# EAGLE design Nixie_ver1 (EAGLE 9.6.2)
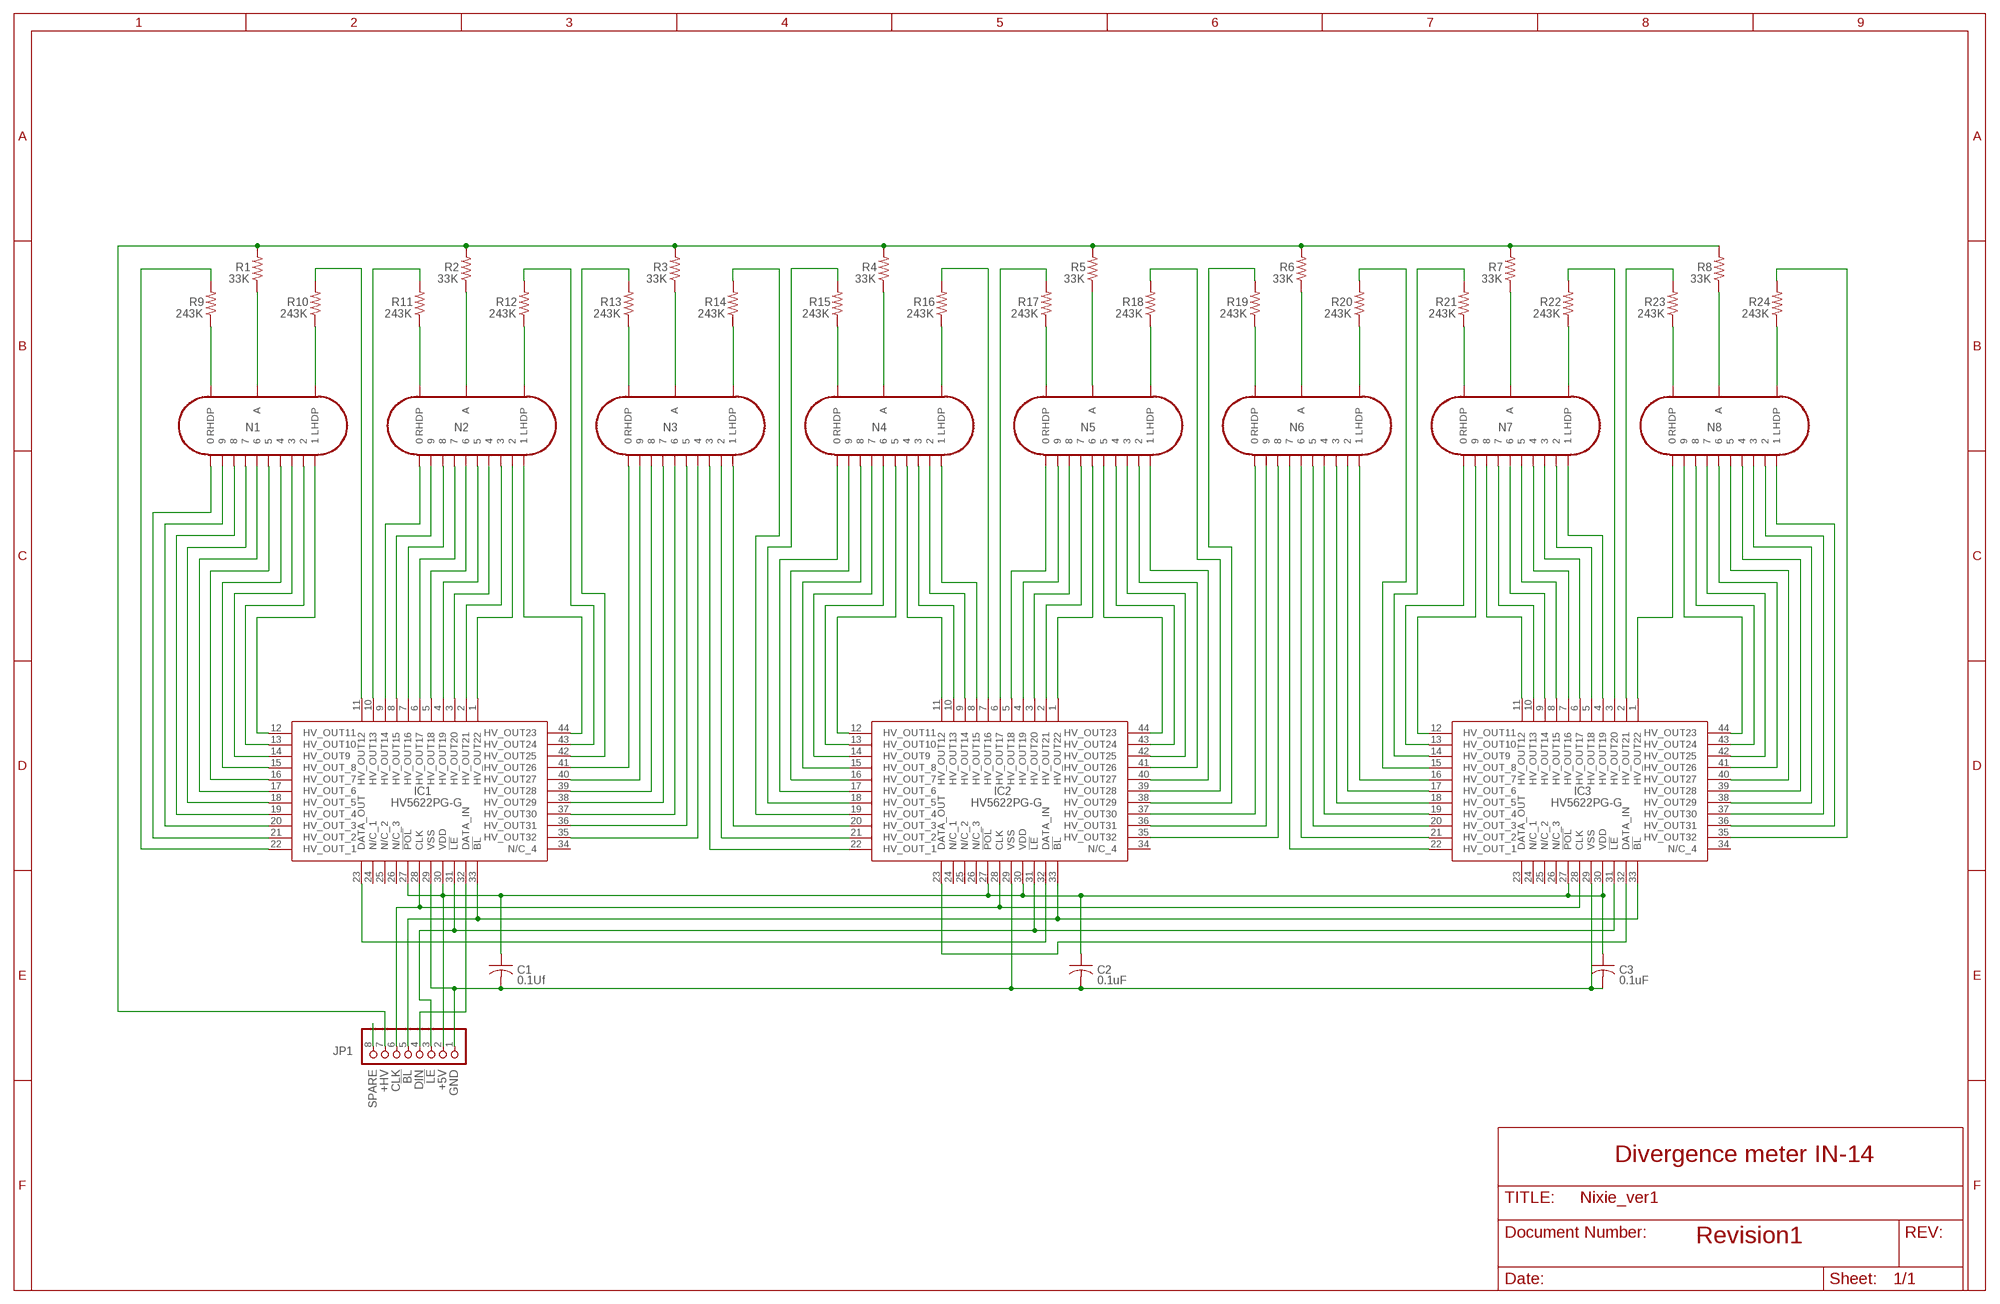
[diagram p0: schematic, sheet 1]

## Parts
C1  0.1Uf  C-US025-024X044  [C025-024X044]
C2  0.1uF  C-US025-024X044  [C025-024X044]
C3  0.1uF  C-US025-024X044  [C025-024X044]
IC1  HV5622PG-G  [QFP80P1390X1390X235-44N]
IC2  HV5622PG-G  [QFP80P1390X1390X235-44N]
IC3  HV5622PG-G  [QFP80P1390X1390X235-44N]
JP1  PINHD-1X8  [1X08]
N1  IN-14  [IN-14]
N2  IN-14  [IN-14]
N3  IN-14  [IN-14]
N4  IN-14  [IN-14]
N5  IN-14  [IN-14]
N6  IN-14  [IN-14]
N7  IN-14  [IN-14]
N8  IN-14  [IN-14]
R1  33K  R-US_0204/7  [0204/7]
R2  33K  R-US_0204/7  [0204/7]
R3  33K  R-US_0204/7  [0204/7]
R4  33K  R-US_0204/7  [0204/7]
R5  33K  R-US_0204/7  [0204/7]
R6  33K  R-US_0204/7  [0204/7]
R7  33K  R-US_0204/7  [0204/7]
R8  33K  R-US_0204/7  [0204/7]
R9  243K  R-US_0204/7  [0204/7]
R10  243K  R-US_0204/7  [0204/7]
R11  243K  R-US_0204/7  [0204/7]
R12  243K  R-US_0204/7  [0204/7]
R13  243K  R-US_0204/7  [0204/7]
R14  243K  R-US_0204/7  [0204/7]
R15  243K  R-US_0204/7  [0204/7]
R16  243K  R-US_0204/7  [0204/7]
R17  243K  R-US_0204/7  [0204/7]
R18  243K  R-US_0204/7  [0204/7]
R19  243K  R-US_0204/7  [0204/7]
R20  243K  R-US_0204/7  [0204/7]
R21  243K  R-US_0204/7  [0204/7]
R22  243K  R-US_0204/7  [0204/7]
R23  243K  R-US_0204/7  [0204/7]
R24  243K  R-US_0204/7  [0204/7]

## Nets
!BL!: IC1.33(!BL) IC2.33(!BL) IC3.33(!BL) JP1.5
!LE!: IC1.31(!LE) IC2.31(!LE) IC3.31(!LE) JP1.3
+5V: C1.1 C2.1 C3.1 IC1.27(!POL) IC1.30(VDD) IC2.27(!POL) IC2.30(VDD) IC3.27(!POL) IC3.30(VDD) JP1.2
+HV: JP1.7 R1.2 R2.2 R3.2 R4.2 R5.2 R6.2 R7.2 R8.2
CLK: IC1.28(CLK) IC2.28(CLK) IC3.28(CLK) JP1.6
DIN: IC1.32(DATA_IN) JP1.4
GND: C1.2 C2.2 C3.2 IC1.29(VSS) IC2.29(VSS) IC3.29(VSS) JP1.1
N$1: IC1.23(DATA_OUT) IC2.32(DATA_IN)
N$2: IC2.23(DATA_OUT) IC3.32(DATA_IN)
N$3: IC1.11(HV_OUT12) R10.2
N$4: IC1.13(HV_OUT10) N1.2
N$5: IC1.14(HV_OUT9) N1.3
N$6: IC1.15(HV_OUT_8) N1.4
N$7: IC1.16(HV_OUT_7) N1.5
N$8: IC1.17(HV_OUT_6) N1.6
N$9: IC1.18(HV_OUT_5) N1.7
N$10: IC1.19(HV_OUT_4) N1.8
N$11: IC1.20(HV_OUT_3) N1.9
N$12: IC1.12(HV_OUT11) N1.1
N$13: IC1.21(HV_OUT_2) N1.0
N$14: IC1.22(HV_OUT_1) R9.2
N$15: N1.RHDP R9.1
N$16: N1.LHDP R10.1
N$17: IC1.10(HV_OUT13) R11.2
N$18: N1.A R1.1
N$19: N2.RHDP R11.1
N$20: N2.A R2.1
N$21: N2.LHDP R12.1
N$22: IC1.9(HV_OUT14) N2.0
N$23: IC1.8(HV_OUT15) N2.9
N$24: IC1.7(HV_OUT16) N2.8
N$25: IC1.6(HV_OUT17) N2.7
N$26: IC1.5(HV_OUT18) N2.6
N$27: IC1.4(HV_OUT19) N2.5
N$28: IC1.3(HV_OUT20) N2.4
N$29: IC1.2(HV_OUT21) N2.3
N$30: IC1.1(HV_OUT22) N2.2
N$31: IC1.44(HV_OUT23) N2.1
N$32: IC1.43(HV_OUT24) R12.2
N$33: IC1.42(HV_OUT25) R13.2
N$34: N3.RHDP R13.1
N$35: N3.A R3.1
N$36: N3.LHDP R14.1
N$37: IC1.41(HV_OUT26) N3.0
N$38: IC1.40(HV_OUT27) N3.9
N$39: IC1.39(HV_OUT28) N3.8
N$40: IC1.38(HV_OUT29) N3.7
N$41: IC1.37(HV_OUT30) N3.6
N$42: IC1.36(HV_OUT31) N3.5
N$43: IC1.35(HV_OUT32) N3.4
N$44: IC2.22(HV_OUT_1) N3.3
N$45: IC2.21(HV_OUT_2) N3.2
N$46: IC2.20(HV_OUT_3) N3.1
N$47: IC2.19(HV_OUT_4) R14.2
N$48: IC2.18(HV_OUT_5) R15.2
N$49: N4.RHDP R15.1
N$50: N4.A R4.1
N$51: N4.LHDP R16.1
N$52: IC2.17(HV_OUT_6) N4.0
N$53: IC2.16(HV_OUT_7) N4.9
N$54: IC2.15(HV_OUT_8) N4.8
N$55: IC2.14(HV_OUT9) N4.7
N$56: IC2.13(HV_OUT10) N4.6
N$57: IC2.1(HV_OUT22) N5.6
N$58: IC2.11(HV_OUT12) N4.4
N$59: IC2.10(HV_OUT13) N4.3
N$60: IC2.9(HV_OUT14) N4.2
N$61: IC2.8(HV_OUT15) N4.1
N$62: IC2.7(HV_OUT16) R16.2
N$63: IC2.6(HV_OUT17) R17.2
N$64: N5.RHDP R17.1
N$65: N5.A R5.1
N$66: N5.LHDP R18.1
N$67: IC2.5(HV_OUT18) N5.0
N$68: IC2.4(HV_OUT19) N5.9
N$69: IC2.3(HV_OUT20) N5.8
N$70: IC2.2(HV_OUT21) N5.7
N$71: N6.RHDP R19.1
N$72: IC2.44(HV_OUT23) N5.5
N$73: IC2.43(HV_OUT24) N5.4
N$74: IC2.42(HV_OUT25) N5.3
N$75: IC2.41(HV_OUT26) N5.2
N$76: IC2.40(HV_OUT27) N5.1
N$77: IC2.39(HV_OUT28) R18.2
N$78: IC2.38(HV_OUT29) R19.2
N$79: IC2.12(HV_OUT11) N4.5
N$80: N6.A R6.1
N$81: N6.LHDP R20.1
N$82: N7.RHDP R21.1
N$83: N7.A R7.1
N$84: N7.LHDP R22.1
N$85: N8.RHDP R23.1
N$86: N8.A R8.1
N$87: N8.LHDP R24.1
N$88: IC2.37(HV_OUT30) N6.0
N$89: IC2.36(HV_OUT31) N6.9
N$90: IC2.35(HV_OUT32) N6.8
N$91: IC3.22(HV_OUT_1) N6.7
N$92: IC3.21(HV_OUT_2) N6.6
N$93: IC3.20(HV_OUT_3) N6.5
N$94: IC3.19(HV_OUT_4) N6.4
N$95: IC3.18(HV_OUT_5) N6.3
N$96: IC3.17(HV_OUT_6) N6.2
N$97: IC3.16(HV_OUT_7) N6.1
N$98: IC3.15(HV_OUT_8) R20.2
N$99: IC3.14(HV_OUT9) R21.2
N$100: IC3.13(HV_OUT10) N7.0
N$101: IC3.12(HV_OUT11) N7.9
N$102: IC3.11(HV_OUT12) N7.8
N$103: IC3.10(HV_OUT13) N7.7
N$104: IC3.9(HV_OUT14) N7.6
N$105: IC3.8(HV_OUT15) N7.5
N$106: IC3.7(HV_OUT16) N7.4
N$107: IC3.6(HV_OUT17) N7.3
N$108: IC3.5(HV_OUT18) N7.2
N$109: IC3.4(HV_OUT19) N7.1
N$110: IC3.3(HV_OUT20) R22.2
N$111: IC3.2(HV_OUT21) R23.2
N$112: IC3.1(HV_OUT22) N8.0
N$113: IC3.44(HV_OUT23) N8.9
N$114: IC3.43(HV_OUT24) N8.8
N$115: IC3.42(HV_OUT25) N8.7
N$116: IC3.41(HV_OUT26) N8.6
N$117: IC3.40(HV_OUT27) N8.5
N$118: IC3.39(HV_OUT28) N8.4
N$119: IC3.38(HV_OUT29) N8.3
N$120: IC3.37(HV_OUT30) N8.2
N$121: IC3.36(HV_OUT31) N8.1
N$122: IC3.35(HV_OUT32) R24.2
SPARE: JP1.8
Unconnected: IC1.24(N/C_1) IC1.25(N/C_2) IC1.26(N/C_3) IC1.34(N/C_4) IC2.24(N/C_1) IC2.25(N/C_2) IC2.26(N/C_3) IC2.34(N/C_4) IC3.23(DATA_OUT) IC3.24(N/C_1) IC3.25(N/C_2) IC3.26(N/C_3) IC3.34(N/C_4)

## Notes on the sheet
- Divergence meter IN-14
- Revision1

## Library data of the parts
C1-C3 = rcl:C-US: CAPACITOR, American symbol; SPICEPREFIX: C
IC1-IC3 = SamacSys_Parts:HV5622PG-G: Serial to Parallel Logic Converters 220V 32Ch Open D Out Source: Datasheet <https://componentsearchengine.com/Datasheets/1/HV5622PG-G.pdf>; DESCRIPTION: Serial to Parallel Logic Converters 220V 32Ch Open D Out; HEIGHT: 2.35mm; MANUFACTURER_NAME: Microchip; MANUFACTURER_PART_NUMBER: HV5622PG-G; MOUSER_PART_NUMBER: 689-HV5622PG-G; MOUSER_PRICE-STOCK: https://www.mouser.co.uk/ProductDetail/Microchip-Technology/HV5622PG-G?qs=jjdktuRV%2Fgg6x1DCsLKbaw%3D%3D
JP1 = pinhead:PINHD-1X8: PIN HEADER
N1-N8 = russian-nixies:IN-14: IN-14: medium numeric frontview nixie tube
R1-R24 = rcl:R-US_: RESISTOR, American symbol; SPICEPREFIX: R

## Board
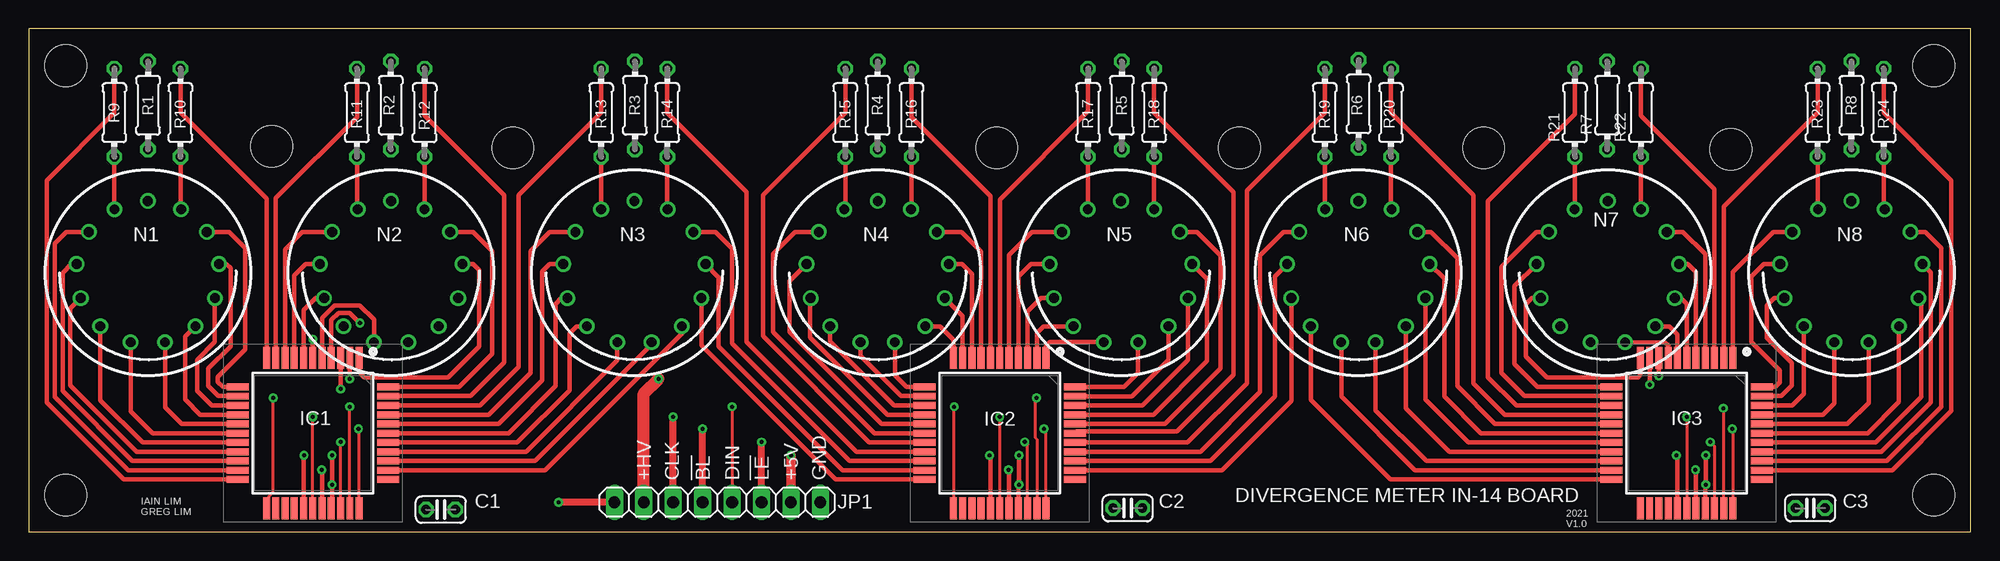
[diagram p1: board, top side]
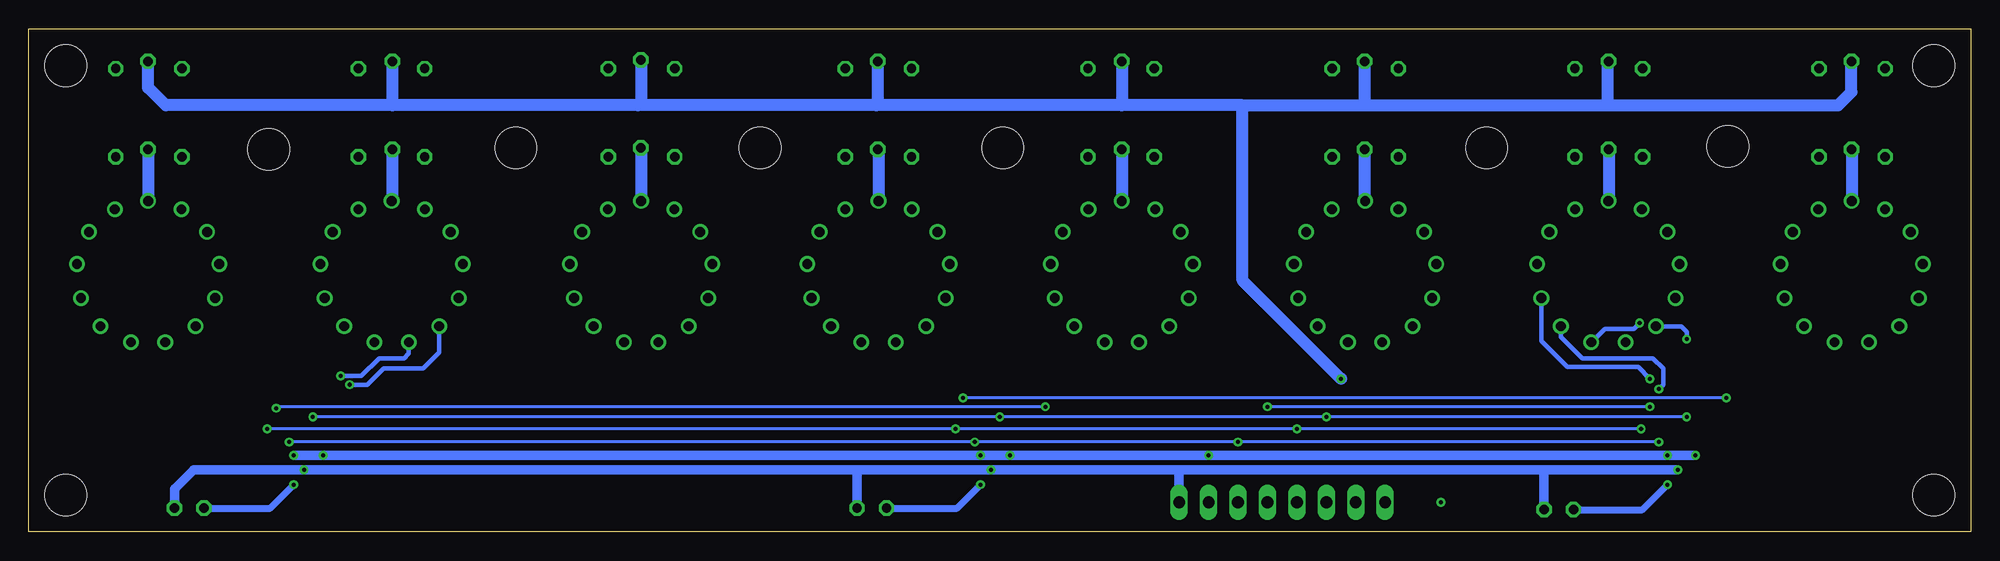
[diagram p2: board, bottom side, seen from below]

Size 167.64 x 43.43 mm. Coordinates in mm from the lower left corner, seen from the top.
Outline: 0,0 167.64,0 167.64,43.43 0,43.43 0,0
Copper layers (1*16): Top 0.035mm / dielectric 1.5mm / Bottom 0.035mm
Design rules "default": minimum track width 6mil, minimum drill 0.35mm, track to track 6mil, track to pad 6mil, pad to pad 6mil, via to via 6mil, smd to smd 6mil, copper to edge 40mil, drill to drill 6mil, minimum pad ring 10mil, minimum via ring 8mil, stop-mask expansion 4mil, vias tented up to drill 0mil, thermal gap 10mil
Holes 3.58 mm at 3.17,3.17 3.17,40.26 164.47,40.26 164.47,3.17 20.95,33.27 41.78,33.15 104.52,33.15 83.57,33.15 125.6,33.15 146.94,33.02

### Footprints (pad centres in the part's own frame; a part is rotated, then mirrored left to right if it is on the bottom)
C025-024X044 = drill 0.813 octagon: 1 -1.27,0; 2 1.27,0
QFP80P1390X1390X235-44N = smd 1.9 x 0.6: 1 -6.5,4; 2 -6.5,3.2; 3 -6.5,2.4; 4 -6.5,1.6; 5 -6.5,0.8; 6 -6.5,0; 7 -6.5,-0.8; 8 -6.5,-1.6; 9 -6.5,-2.4; 10 -6.5,-3.2; 11 -6.5,-4; 23 6.5,-4; 24 6.5,-3.2; 25 6.5,-2.4; 26 6.5,-1.6; 27 6.5,-0.8; 28 6.5,0; 29 6.5,0.8; 30 6.5,1.6; 31 6.5,2.4; 32 6.5,3.2; 33 6.5,4 | smd 0.6 x 1.9: 12 -4,-6.5; 13 -3.2,-6.5; 14 -2.4,-6.5; 15 -1.6,-6.5; 16 -0.8,-6.5; 17 0,-6.5; 18 0.8,-6.5; 19 1.6,-6.5; 20 2.4,-6.5; 21 3.2,-6.5; 22 4,-6.5; 34 4,6.5; 35 3.2,6.5; 36 2.4,6.5; 37 1.6,6.5; 38 0.8,6.5; 39 0,6.5; 40 -0.8,6.5; 41 -1.6,6.5; 42 -2.4,6.5; 43 -3.2,6.5; 44 -4,6.5
1X08 = drill 1.016 long: 1 -8.89,0; 2 -6.35,0; 3 -3.81,0; 4 -1.27,0; 5 1.27,0; 6 3.81,0; 7 6.35,0; 8 8.89,0
IN-14 = drill 0.84: 0 5.094,-3.516; 1 -5.094,-3.516; 2 -6.145,-0.746; 3 -5.788,2.195; 4 -4.105,4.633; 5 -1.481,6.01; 6 1.481,6.01; 7 4.105,4.633; 8 5.788,2.195; 9 6.145,-0.746; A 0,-6.19; LHDP -2.877,-5.481; RHDP 2.877,-5.481
0204/7 = drill 0.813 octagon: 1 -3.81,0; 2 3.81,0

### Placement (x,y rotation side)
C1  35.56,1.91 0 top
C2  94.87,2.03 0 top
C3  153.8,2.03 0 top
IC1  24.51,8.51 270 top
IC2  83.82,8.51 270 top
IC3  143.13,8.51 270 top
JP1  59.44,2.54 180 top
N1  10.26,22.38 180 top
N2  31.27,22.38 180 top
N3  52.27,22.38 180 top
N4  73.28,22.38 180 top
N5  94.28,22.38 180 top
N6  114.78,22.38 180 top
N7  136.32,22.38 180 top
N8  157.35,22.38 180 top
R1  10.29,36.83 90 top
R2  31.24,36.83 90 top
R3  52.32,36.83 90 top
R4  73.28,36.83 90 top
R5  94.36,36.83 90 top
R6  114.81,36.96 90 top
R7  136.27,36.83 90 top
R8  157.35,36.83 90 top
R9  7.37,36.2 90 top
R10  13.08,36.2 90 top
R11  28.32,36.2 90 top
R12  34.16,36.2 90 top
R13  49.4,36.2 90 top
R14  55.12,36.2 90 top
R15  70.48,36.2 90 top
R16  76.2,36.2 90 top
R17  91.44,36.2 90 top
R18  97.16,36.2 90 top
R19  111.89,36.2 90 top
R20  117.6,36.2 90 top
R21  133.48,36.2 90 top
R22  139.19,36.2 90 top
R23  154.43,36.2 90 top
R24  160.15,36.2 90 top

### Tracks (layer width: path | path; a pad name or v marks a point on that pad's centre or on a via)
!BL!  (via drill 0.35)
  Top 0.254: IC1.33 28.51,8.83 v28.45,8.89 | v147.07,8.89 147.13,8.83 IC3.33 | IC2.33 87.82,8.7 v87.63,8.89
  Top 0.61: JP1.5 v58.17,8.89
  Bottom 0.254: v28.45,8.89 v58.17,8.89 v87.63,8.89 v147.07,8.89
!LE!  (via drill 0.35)
  Top 0.254: IC1.31 26.91,7.73 v26.92,7.75 | v145.16,7.75 145.53,7.38 IC3.31 | IC2.31 86.22,7.51 v85.98,7.75
  Top 0.61: JP1.3 v63.25,7.75
  Bottom 0.254: v26.92,7.75 v63.25,7.75 v85.98,7.75 v145.16,7.75
+5V  (via drill 0.35)
  Top 0.406: IC1.30 26.16,2.06 v26.16,4.06 v26.16,6.6 | 85.42,4.01 IC2.30 | 144.73,4.01 IC3.30 | v144.78,4.06 v144.78,6.6 | v85.47,4.06 v85.47,6.6 | IC1.27 23.71,6.57 v23.75,6.6 | IC2.27 83.02,6.51 v82.93,6.6 | IC3.27 142.33,6.51 v142.24,6.6
  Top 0.61: v85.47,4.06 85.42,4.01 | v144.78,4.06 144.73,4.01
  Top 0.813: JP1.2 v65.79,6.6
  Bottom 0.61: C1.1 28.32,1.91 v26.16,4.06 | C2.1 87.5,2.03 v85.47,4.06 | C3.1 146.81,2.03 v144.78,4.06
  Bottom 0.813: v144.78,6.6 v142.24,6.6 v85.47,6.6 v82.93,6.6 v65.79,6.6 v26.16,6.6 v23.75,6.6
+HV  (via drill 0.35)
  Top 1.016: JP1.7 53.09,11.94 v54.36,13.21
  Bottom 1.016: v54.36,13.21 62.87,21.72 62.87,36.83 | 62.87,36.83 52.32,36.83 | R3.2 52.32,36.83 | R8.2 157.35,38.35 155.83,36.83 136.27,36.83 | 62.87,36.83 73.28,36.83 | 73.28,36.83 94.49,36.83 | 94.49,36.83 115.06,36.83 | 115.06,36.83 136.27,36.83 | R7.2 136.27,36.83 | R6.2 114.81,37.08 115.06,36.83 | R5.2 94.36,36.96 94.49,36.83 | R4.2 73.28,36.83 | R1.2 10.29,37.97 11.43,36.83 31.37,36.83 | 52.32,36.83 31.37,36.83 | R2.2 31.37,40.51 31.37,36.83
CLK  (via drill 0.35)
  Top 0.254: IC1.28 v24.51,9.91 | v143.13,9.91 IC3.28 | IC2.28 v83.82,9.91
  Top 0.61: JP1.6 v55.63,9.91
  Bottom 0.254: v24.51,9.91 v55.63,9.91 v83.82,9.91 v143.13,9.91
DIN  (via drill 0.35)
  Top 0.254: IC1.32 27.71,10.77 v27.69,10.79 | v60.71,10.79 JP1.4
  Bottom 0.254: v27.69,10.79 v60.71,10.79
GND  (via drill 0.35)
  Top 0.406: IC3.29 143.93,5.3 v143.89,5.33 | IC2.29 84.62,5.3 v84.58,5.33 | IC1.29 25.31,5.3 v25.27,5.33
  Bottom 0.61: 68.27,2.54 JP1.1
  Bottom 0.813: 36.83,5.33 C1.2 | 36.83,5.33 68.33,5.33 | 68.33,5.33 68.33,2.59 68.27,2.54 | 68.33,5.33 v84.58,5.33 96.14,5.33 | 96.14,5.33 C2.2 | 96.14,5.33 v143.89,5.33 153.42,5.33 155.07,3.68 C3.2 | v25.27,5.33 36.83,5.33
N$1  (via drill 0.35)
  Top 0.254: IC1.23 20.73,2.23 20.73,3.08 21.08,3.42 v21.08,11.56 | v87,11.56 86.87,11.43 86.87,8.13 87.02,7.98 IC2.32
  Bottom 0.254: v21.08,11.56 v87,11.56
N$2  (via drill 0.35)
  Top 0.254: IC2.23 79.88,2.07 v79.88,10.79 | v146.3,10.67 146.3,2.03 IC3.32
  Bottom 0.254: v79.88,10.79 146.18,10.79 v146.3,10.67
N$3
  Top 0.406: IC1.11 20.51,28.77 13.08,36.2 R10.2
N$4
  Top 0.406: N1.2 17.04,23.12 17.4,22.77 17.4,16 15.49,14.1 15.49,12.57 16.36,11.71 IC1.13
N$5
  Top 0.406: IC1.14 15.76,10.91 14.53,12.14 14.53,14.85 16.05,16.37 N1.3
N$6
  Top 0.406: IC1.15 14.78,10.11 13.48,11.41 13.48,16.86 N1.4
N$7
  Top 0.406: IC1.16 13.17,9.31 11.74,10.74 N1.5
N$8
  Top 0.406: IC1.17 10.67,8.51 8.78,10.4 N1.6
N$9
  Top 0.406: IC1.18 9.8,7.71 6.16,11.36 N1.7
N$10
  Top 0.406: N1.8 3.58,19.29 3.58,12.63 9.3,6.91 IC1.19
N$11
  Top 0.406: IC1.20 8.93,6.11 2.9,12.15 2.9,22.35 3.67,23.12 N1.9
N$12
  Top 0.406: IC1.12 16.75,12.51 16.31,12.95 16.31,13.39 18.67,15.75 18.67,24.51 17.29,25.89 N1.1
N$13
  Top 0.406: N1.0 3.21,25.89 2.21,24.89 2.21,11.66 8.56,5.31 IC1.21
N$14
  Top 0.406: R9.2 7.37,36.2 1.52,30.35 1.52,11.18 8.19,4.51 IC1.22
N$15
  Top 0.406: R9.1 7.37,27.88 N1.RHDP
N$16
  Top 0.406: R10.1 13.08,27.92 N1.LHDP
N$17
  Top 0.406: IC1.10 21.31,28.8 28.32,35.81 R11.2
N$18
  Bottom 1.016: R1.1 10.26,32.99 N1.A
N$19
  Top 0.406: R11.1 28.32,27.93 N2.RHDP
N$20
  Bottom 1.016: R2.1 31.24,28.59 N2.A
N$21
  Top 0.406: R12.1 34.16,27.88 N2.LHDP
N$22
  Top 0.406: IC1.9 22.11,24.4 23.61,25.89 N2.0
N$23
  Top 0.406: N2.9 23.88,23.11 22.91,22.15 IC1.8
N$24
  Top 0.406: N2.8 24.75,20.18 23.71,19.14 IC1.7
N$25  (via drill 0.35)
  Top 0.406: IC1.6 v24.51,16.64
  Bottom 0.406: v24.51,16.64 24.51,17.27 24.98,17.74 N2.7
N$26
  Top 0.406: IC1.5 25.31,18.45 26.42,19.56 28.57,19.56 29.79,18.35 N2.6
N$27  (via drill 0.35)
  Top 0.406: IC1.4 26.11,18.28 26.74,18.9 27.71,18.9 v28.57,18.03
  Bottom 0.406: v28.57,18.03 29.08,17.53 31.59,17.53 N2.5
N$28  (via drill 0.35)
  Top 0.406: IC1.3 26.91,12.33 v26.92,12.32
  Bottom 0.406: v26.92,12.32 26.54,12.7 26.54,14.1 27.43,14.99 33.53,14.99 35.37,16.83 N2.4
N$29  (via drill 0.35)
  Top 0.406: IC1.2 27.71,13.23 v27.69,13.21
  Bottom 0.406: v27.69,13.21 28.7,14.22 34.8,14.22 37.05,16.48 N2.3
N$30
  Top 0.406: IC1.1 28.51,13.78 28.96,13.34 36.2,13.34 38.86,16 38.86,22.61 38.34,23.12 N2.2
N$31
  Top 0.406: N2.1 38.37,25.89 40.01,24.26 40.01,15.37 37.15,12.51 IC1.44
N$32
  Top 0.406: R12.2 34.16,35.94 41.02,29.08 41.02,14.61 38.12,11.71 IC1.43
N$33
  Top 0.406: IC1.42 38.98,10.91 42.29,14.22 42.29,29.08 49.4,36.2 R13.2
N$34
  Top 0.406: R13.1 N3.RHDP
N$35
  Bottom 1.016: R3.1 52.32,28.62 N3.A
N$36
  Top 0.406: R14.1 55.12,27.89 N3.LHDP
N$37
  Top 0.406: IC1.41 39.7,10.11 43.31,13.72 43.31,24.26 44.94,25.89 N3.0
N$38
  Top 0.406: N3.9 44.97,23.12 44.32,22.48 44.32,13.08 40.55,9.31 IC1.40
N$39
  Top 0.406: N3.8 45.96,20.18 45.47,19.68 45.47,12.57 41.4,8.51 IC1.39
N$40
  Top 0.406: N3.7 47.28,17.74 46.66,17.12 46.66,12.21 42.15,7.71 IC1.38
N$41
  Top 0.406: N3.6 50.79,14.79 42.91,6.91 IC1.37
N$42
  Top 0.406: IC1.36 43.7,6.11 53.76,16.16 N3.5
N$43
  Top 0.406: IC1.35 44.55,5.31 56.38,17.14 N3.4
N$44
  Top 0.406: N3.3 58.06,16.11 69.66,4.51 IC2.22
N$45
  Top 0.406: N3.2 59.56,21.98 59.56,16 70.26,5.31 IC2.21
N$46
  Top 0.406: IC2.20 70.85,6.11 60.71,16.26 60.71,24.46 59.27,25.89 N3.1
N$47
  Top 0.406: IC2.19 71.45,6.91 61.98,16.38 61.98,29.34 55.12,36.2 R14.2
N$48
  Top 0.406: IC2.18 72.56,7.71 63.37,16.89 63.37,29.08 70.48,36.2 R15.2
N$49
  Top 0.406: R15.1 70.48,27.94 N4.RHDP
N$50
  Bottom 1.016: R4.1 N4.A
N$51
  Top 0.406: R16.1 76.2,27.9 N4.LHDP
N$52
  Top 0.406: N4.0 66.15,25.89 64.26,24 64.26,17.27 73.03,8.51 IC2.17
N$53
  Top 0.406: IC2.16 73.62,9.31 65.66,17.27 65.66,21.65 N4.9
N$54
  Top 0.406: IC2.15 74.12,10.11 67.44,16.79 67.44,20.18 N4.8
N$55
  Top 0.406: N4.7 69.17,16.42 74.69,10.91 IC2.14
N$56
  Top 0.406: IC2.13 75.29,11.71 71.8,15.2 N4.6
N$57
  Top 0.406: IC2.1 87.82,16.07 88.14,16.38 92.79,16.38 N5.6
N$58
  Top 0.406: IC2.11 79.82,16.57 78.65,17.74 N4.4
N$59
  Top 0.406: IC2.10 80.62,18.63 N4.3
N$60
  Top 0.406: IC2.9 81.42,22.27 80.57,23.12 N4.2
N$61
  Top 0.406: IC2.8 82.22,24.21 80.53,25.89 N4.1
N$62
  Top 0.406: IC2.7 83.02,28.99 76.2,35.81 R16.2
N$63
  Top 0.406: R17.2 91.44,36.32 83.82,28.7 IC2.6
N$64
  Top 0.406: R17.1 91.44,27.89 N5.RHDP
N$65
  Bottom 1.016: R5.1 94.28,32.94 N5.A
N$66
  Top 0.406: R18.1 N5.LHDP
N$67
  Top 0.406: N5.0 86.6,25.89 84.62,23.91 IC2.5
N$68
  Top 0.406: N5.9 86.5,23.12 85.42,22.05 IC2.4
N$69
  Top 0.406: N5.8 87.36,20.18 86.22,19.04 IC2.3
N$70
  Top 0.406: N5.7 87.59,17.74 87.02,17.17 IC2.2
N$71
  Top 0.406: R19.1 111.89,27.88 N6.RHDP
N$72
  Top 0.406: N5.5 95.77,13.72 94.55,12.51 IC2.44
N$73
  Top 0.406: N5.4 98.39,14.82 95.25,11.68 90.34,11.68 IC2.43
N$74
  Top 0.406: IC2.42 96.13,10.91 100.07,14.86 N5.3
N$75
  Top 0.406: N5.2 101.73,21.83 101.73,14.73 97.1,10.11 IC2.41
N$76
  Top 0.406: N5.1 100.85,25.89 102.87,23.88 102.87,14.1 98.08,9.31 IC2.40
N$77
  Top 0.406: R18.2 97.16,36.2 104.01,29.34 104.01,13.56 99.11,8.65 90.46,8.65 IC2.39
N$78
  Top 0.406: R19.2 111.89,36.2 105.16,29.46 105.16,12.83 100.04,7.71 IC2.38
N$79
  Top 0.406: N4.5 74.76,13.51 75.76,12.51 IC2.12
N$80
  Bottom 1.016: R6.1 114.78,33.12 N6.A
N$81
  Top 0.406: R20.1 117.6,27.92 N6.LHDP
N$82
  Top 0.406: R21.1 133.48,27.89 N7.RHDP
N$83
  Bottom 1.016: R7.1 136.27,28.62 N7.A
N$84
  Top 0.406: R22.1 N7.LHDP
N$85
  Top 0.406: R23.1 154.43,27.9 N8.RHDP
N$86
  Bottom 1.016: R8.1 N8.A
N$87
  Top 0.406: R24.1 160.15,27.94 N8.LHDP
N$88
  Top 0.406: N6.0 108.32,25.89 106.3,23.88 106.3,12.06 101.14,6.91 IC2.37
N$89
  Top 0.406: IC2.36 101.99,6.11 107.57,11.68 107.57,22.05 N6.9
N$90
  Top 0.406: IC2.35 103,5.31 109,11.3 N6.8
N$91
  Top 0.406: N6.7 110.68,11.37 117.54,4.51 IC3.22
N$92
  Top 0.406: N6.6 113.3,11.67 119.66,5.31 IC3.21
N$93
  Top 0.406: IC3.20 120.64,6.11 116.26,10.48 N6.5
N$94
  Top 0.406: N6.4 118.89,10.65 122.63,6.91 IC3.19
N$95
  Top 0.406: IC3.18 124.28,7.71 120.57,11.42 N6.3
N$96
  Top 0.406: N6.2 122.2,21.85 122.2,11.69 125.38,8.51 IC3.17
N$97
  Top 0.406: N6.1 121.05,25.89 123.32,23.62 123.32,12.57 126.58,9.31 IC3.16
N$98
  Top 0.406: IC3.15 127.43,10.11 124.71,12.83 124.71,29.08 117.6,36.2 R20.2
N$99
  Top 0.406: R21.2 133.48,36.07 125.98,28.57 125.98,13.34 128.41,10.91 IC3.14
N$100
  Top 0.406: IC3.13 129.13,11.71 127.13,13.72 127.13,22.86 130.16,25.89 N7.0
N$101
  Top 0.406: IC3.12 130.24,12.51 128.27,14.48 128.27,21.22 N7.9
N$102
  Top 0.406: IC3.11 139.13,13.53 138.94,13.34 131.06,13.34 129.26,15.13 129.26,19.67 129.77,20.18 N7.8
N$103  (via drill 0.35)
  Top 0.406: IC3.10 139.93,12.72 v139.95,12.7
  Bottom 0.406: v139.95,12.7 138.43,12.7 137.03,14.1 133.6,14.1 132.22,15.48 N7.7
N$104  (via drill 0.35)
  Top 0.406: IC3.9 140.73,13.47 v140.72,13.46
  Bottom 0.406: v140.72,13.46 138.94,13.46 137.41,14.99 135.25,14.99 134.84,15.4 N7.6
N$105
  Top 0.406: IC3.8 141.53,16.08 141.24,16.37 N7.5
N$106
  Top 0.406: IC3.7 142.33,17.06 141.64,17.74 N7.4
N$107
  Top 0.406: IC3.6 143.13,19.67 142.62,20.18 N7.3
N$108
  Top 0.406: IC3.5 143.93,22.42 143.23,23.12 N7.2
N$109
  Top 0.406: IC3.4 144.73,23.98 142.81,25.89 N7.1
N$110
  Top 0.406: IC3.3 145.53,29.6 139.19,35.94 R22.2
N$111
  Top 0.406: IC3.2 146.33,28.09 154.43,36.2 R23.2
N$112
  Top 0.406: IC3.1 147.13,22.41 150.61,25.89 N8.0
N$113
  Top 0.406: IC3.44 150.78,12.51 151.18,12.9 151.18,13.92 148.72,16.38 148.72,22.03 149.81,23.12 N8.9
N$114
  Top 0.406: N8.8 150.68,20.18 150.04,19.55 150.04,16.75 152.2,14.59 152.2,12.63 151.28,11.71 IC3.43
N$115
  Top 0.406: N8.7 153.25,11.9 152.26,10.91 IC3.42
N$116
  Top 0.406: IC3.41 154.89,10.11 155.87,11.09 N8.6
N$117
  Top 0.406: N8.5 158.83,11.13 157.01,9.31 IC3.40
N$118
  Top 0.406: IC3.39 158.75,8.51 161.46,11.22 N8.4
N$119
  Top 0.406: N8.3 163.4,19.93 163.4,11.63 159.47,7.71 IC3.38
N$120
  Top 0.406: IC3.37 159.94,6.91 164.21,11.18 164.21,22.41 N8.2
N$121
  Top 0.406: N8.1 163.72,25.89 165.1,24.51 165.1,10.79 160.41,6.11 IC3.36
N$122
  Top 0.406: R24.2 160.15,36.2 165.99,30.35 165.99,10.41 160.88,5.31 IC3.35
SPARE  (via drill 0.35)
  Top 0.61: JP1.8 v45.72,2.54

### Text on the board
tNames: +HV | CLK | !BL! | DIN | !LE! | +5V | GND | DIVERGENCE METER IN-14 BOARD | IAIN LIM / GREG LIM | 2021 / V1.0